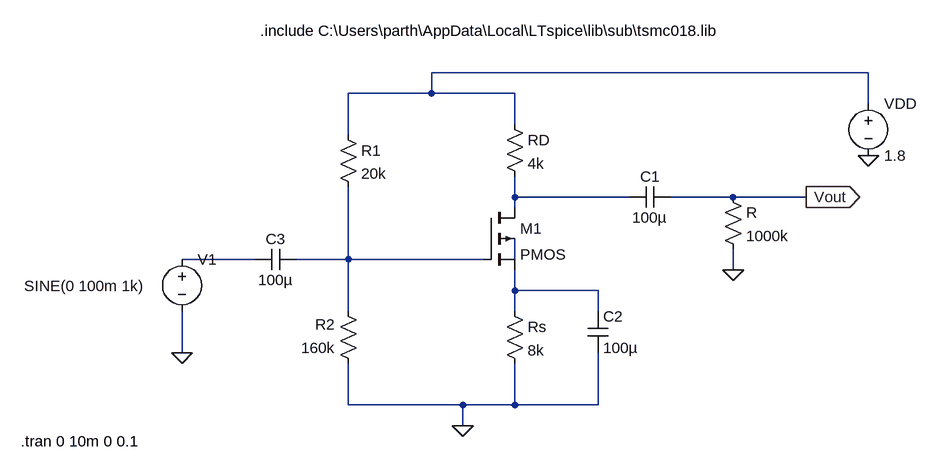
[diagram p0: schematic Draft1.asc]
Draft1.asc, the LTspice schematic file:
Version 4
SHEET 1 880 744
WIRE 576 80 -96 80
WIRE -96 112 -96 80
WIRE -96 112 -224 112
WIRE 32 112 -96 112
WIRE 576 128 576 80
WIRE 32 160 32 112
WIRE -224 176 -224 112
WIRE 32 272 32 240
WIRE 208 272 32 272
WIRE 368 272 272 272
WIRE 480 272 368 272
WIRE 32 288 32 272
WIRE -368 368 -480 368
WIRE -224 368 -224 256
WIRE -224 368 -304 368
WIRE -16 368 -224 368
WIRE 32 368 32 336
WIRE 368 384 368 352
WIRE 32 416 32 384
WIRE 160 416 32 416
WIRE -224 448 -224 368
WIRE 32 448 32 416
WIRE 160 448 160 416
WIRE -480 512 -480 448
WIRE -224 592 -224 528
WIRE -48 592 -224 592
WIRE 32 592 32 528
WIRE 32 592 -48 592
WIRE 160 592 160 512
WIRE 160 592 32 592
WIRE -48 624 -48 592
FLAG -48 624 0
FLAG 368 384 0
FLAG -480 512 0
FLAG 576 208 0
FLAG 480 272 Vout
IOPIN 480 272 Out
SYMBOL res 16 144 R0
SYMATTR InstName RD
SYMATTR Value 4k
SYMBOL cap 272 256 R90
WINDOW 0 0 32 VBottom 2
WINDOW 3 32 32 VTop 2
SYMATTR InstName C1
SYMATTR Value 100µ
SYMBOL res 352 256 R0
SYMATTR InstName R
SYMATTR Value 1000k
SYMBOL res 16 432 R0
SYMATTR InstName Rs
SYMATTR Value 8k
SYMBOL cap 144 448 R0
SYMATTR InstName C2
SYMATTR Value 100µ
SYMBOL res -208 544 R180
WINDOW 0 36 76 Left 2
WINDOW 3 36 40 Left 2
SYMATTR InstName R2
SYMATTR Value 160k
SYMBOL res -240 160 R0
SYMATTR InstName R1
SYMATTR Value 20k
SYMBOL cap -304 352 R90
WINDOW 0 0 32 VBottom 2
WINDOW 3 32 32 VTop 2
SYMATTR InstName C3
SYMATTR Value 100µ
SYMBOL voltage 576 112 R0
WINDOW 123 0 0 Left 0
WINDOW 39 0 0 Left 0
SYMATTR InstName VDD
SYMATTR Value 1.8
SYMBOL pmos4 -16 288 R0
SYMATTR InstName M1
SYMATTR Value2 l=0.2u w=4u
SYMBOL voltage -480 352 R0
WINDOW 123 24 124 Left 2
WINDOW 39 0 0 Left 0
WINDOW 3 -243 57 Left 2
SYMATTR Value SINE(0 100m 1k)
SYMATTR InstName V1
TEXT -360 16 Left 2 !.include C:\\Users\\parth\\AppData\\Local\\LTspice\\lib\\sub\\tsmc018.lib
TEXT -728 648 Left 2 !.tran 0 10m 0 0.1

The netlist it stands for:
* Draft1.asc
RD N001 N002 4k
C1 Vout N002 100µ
R Vout 0 1000k
Rs N006 0 8k
C2 N006 0 100µ
R2 0 N004 160k
R1 N001 N004 20k
C3 N004 N003 100µ
VDD N001 0 1.8
M1 N002 N004 N006 N005 PMOS l=0.2u w=4u
V1 N003 0 SINE(0 100m 1k)
.model NMOS NMOS
.model PMOS PMOS
.lib standard.mos
.include C:\Users\parth\AppData\Local\LTspice\lib\sub\tsmc018.lib
.tran 0 10m 0 0.1
.backanno
.end